# Altium schematic sheet motor_controller_interface.SchDoc: RMS & Precharge Interface
size A4; Engineer: Shelby Riggleman; Organization: Badgerloop Electrical; Address1: 133 Engineering Research Building; Address2: 1500 Engineering Drive; Address3: Madison, Wi 53706; Revision: A
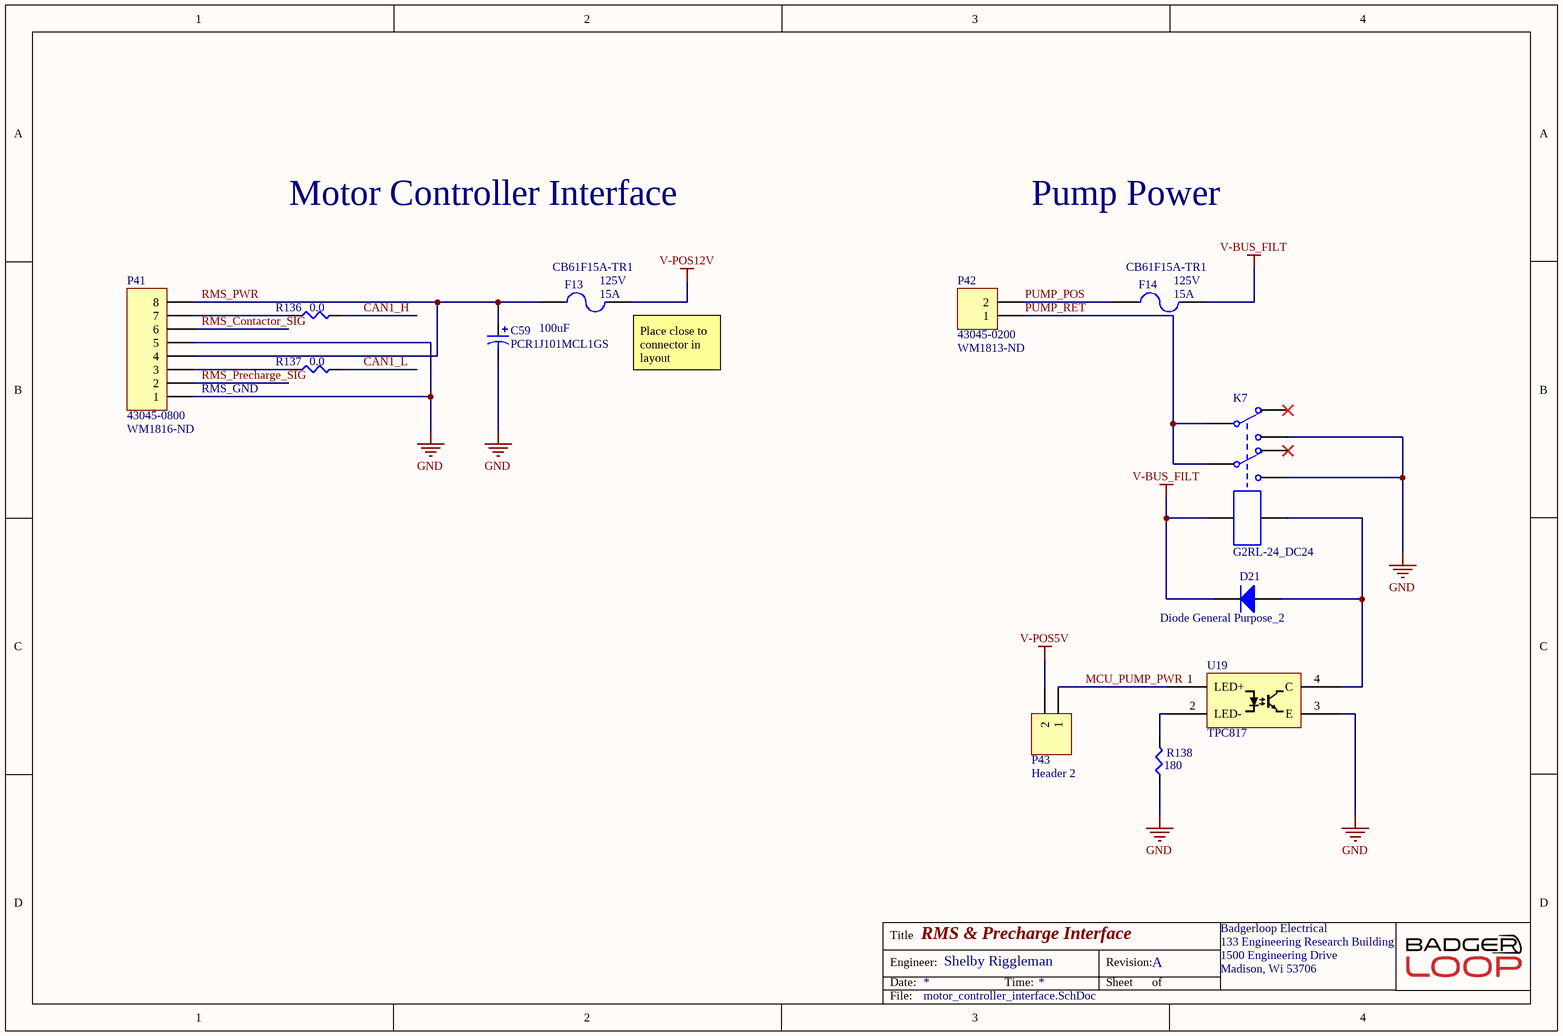
[diagram p0: motor_controller_interface.SchDoc]

## Parts
C59  PCR1J101MCL1GS  Capacitance: 100uF  [CAPAE110103X126M]
D21  Diode General Purpose_2  [SODFL250X110-2N]
F13  CB61F15A-TR1  Current Rating: 15A  Voltage Rating: 125V  [RESC6132X26N]
F14  CB61F15A-TR1  Current Rating: 15A  Voltage Rating: 125V  [RESC6132X26N]
K7  G2RL-24_DC24  [G2RL]
P41  43045-0800  Supplier Part Number 1: WM1816-ND  [430450800]
P42  43045-0200  Supplier Part Number 1: WM1813-ND  [430450200]
P43  Header 2  [Pin Header 1x2 TH Pitch 2.54mm]
R136  0.0  [SMD-1206-RES]
R137  0.0  [SMD-1206-RES]
R138  180  [SMD-0805-RES]
U19  TPC817  [SOT200P1005X328-5N]

## Nets
GND: C59.2 K7.4 K7.7 P41.1 P41.5 R138.1 U19.3(E)
V-BUS_FILT: D21.2(K) F14.2 K7.1
V-POS5V: P43.2
V-POS12V: F13.2
CAN1_H: R136.2
CAN1_L: R137.2
MCU_PUMP_PWR: P43.1 U19.1(LED+)
PUMP_POS: F14.1 P42.2
PUMP_RET: K7.3 K7.6 P42.1
RMS_Contactor_SIG: P41.6
RMS_Precharge_SIG: P41.2
RMS_PWR: C59.1 F13.1 P41.4 P41.8
NetD21_1: D21.1(A) K7.8 U19.4(C)
NetP41_3: P41.3 R137.1
NetP41_7: P41.7 R136.1
NetR138_2: R138.2 U19.2(LED-)

Not connected (* = marked no-connect by the designer): K7 2* 5*

## Notes on the sheet
- Motor Controller Interface
- Pump Power
- (near F13) Place close to connector in layout
- (near P41) RMS_GND
- Title
- Engineer:
- Date:
- Time:
- Revision:
- Sheet
- of
- File:

## Library data of the parts
C59 = PCR1J101MCL1GS: CAP ALUM POLY 100UF 20% 63V SMD; Manufacturer: Nichicon; ESR (Equivalent Series Resistance): 24mR; Ripple Current: 3A; Leakage Current: 3uA; Life (Hours): 4000Hour; Dissipation Factor: 0.08%; Supplier 1: Digi-Key; Manufacturer Part Number: PCR1J101MCL1GS; Stock 1: 11476; Pricing 1: 1=3.63000, 10=2.92800, 100=2.28380 (USD); RoHS: Yes; Mount: Surface Mount,PCB; Case/Package: Radial; Weight: 0.045856oz; Min Operating Temperature: -55°C; Max Operating Temperature: 125°C; Tolerance: 20%; Voltage Rating (DC): 63V; Package Quantity: 1; Packaging: Tape and Reel; Voltage Rating: 63V; Termination: SMD/SMT; Voltage: 63V; Diameter: 10mm; Length: 12.7mm; Height: 12.7mm; Height - Seated (Max): 0.504inch; Depth: 10.3mm; Lead Pitch: 4.6mm; Lead Free: Lead Free; ComponentLink1URL: https://datasheet.ciiva.com/29551/e-ch-ta-29551389.pdf?src-supplier=Digi-Key; ComponentLink1Description: https://datasheet.ciiva.com/29551/e-ch-ta-29551389.pdf?src-supplier=Digi-Key; ComponentLink2URL: https://datasheet.ciiva.com/29551/e-ch-ta-29551390.pdf?src-supplier=Digi-Key; ComponentLink2Description: https://datasheet.ciiva.com/29551/e-ch-ta-29551390.pdf?src-supplier=Digi-Key; ComponentLink3URL: https://datasheet.ciiva.com/29551/e-ch-ta-29551391.pdf?src-supplier=Digi-Key; ComponentLink3Description: https://datasheet.ciiva.com/29551/e-ch-ta-29551391.pdf?src-supplier=Digi-Key; Supplier Part Number 1: 493-13783-1-ND
D21 = Diode General Purpose_2: DIODE GEN PURP 20V 350MA SOD323; Manufacturer: Diodes Incorporated; Manufacturer P/N: SD103CWS-7-F; Digikey P/N: SD103CWS-FDIDKR-ND; Package / Case: SOD323; Do Not Populate: *; ComponentLink1Description: Digikey; ComponentLink1URL: https://www.digikey.com/product-detail/en/diodes-incorporated/SD103CWS-7-F/SD103CWS-FDIDKR-ND/1836772; ComponentLink2Description: Datasheet; ComponentLink2URL: https://www.diodes.com/assets/Datasheets/ds30101.pdf; ComponentLink3Description: Dimensions; ComponentLink3URL: https://www.diodes.com/assets/Package-Files/SOD323.pdf
F13 F14 = CB61F15A-TR1: Manufacturer: Eaton; DC Cold Resistance: 4mR; Fuse Type: Board Mount (Cartridge Style Excluded); Approvals: cULus,PSE; Supplier 1: Digi-Key; Manufacturer Part Number: CB61F15A-TR1; Stock 1: 11809; Pricing 1: 1=1.15000, 5=1.11800, 10=1.04600, 50=0.86600, 100=0.72160, 250=0.70356, 500=0.59532 (USD); RoHS: Yes; Mount: Surface Mount; Case/Package: SMD/SMT; Packaging: Tape and Reel; Voltage Rating (AC): 125V; Voltage Rating (DC): 125V; Length: 0.24inch; Height: 0.101inch; Width: 0.101inch; Depth: 2.57mm; Lead Free: Lead Free; ComponentLink1URL: http://components.arrow.com/part/dataview/0323_05918082?src-supplier=Arrow+Europe; ComponentLink1Description: http://components.arrow.com/part/dataview/0323_05918082?src-supplier=Arrow+Europe; ComponentLink2URL: http://www.cooperindustries.com/content/dam/public/bussmann/Electronics/Resources/product-datasheets/bus-elx-ds-4377-cb61f.pdf?src-supplier=Avnet+Asia; ComponentLink2Description: http://www.cooperindustries.com/content/dam/public/bussmann/Electronics/Resources/product-datasheets/bus-elx-ds-4377-cb61f.pdf?src-supplier=Avnet+Asia; ComponentLink3URL: http://www.cooperindustries.com/content/dam/public/bussmann/Electronics/Resources/product-datasheets/bus-elx-ds-4377-cb61f.pdf?src-supplier=Avnet; ComponentLink3Description: http://www.cooperindustries.com/content/dam/public/bussmann/Electronics/Resources/product-datasheets/bus-elx-ds-4377-cb61f.pdf?src-supplier=Avnet; ComponentLink4URL: http://www.cooperindustries.com/content/dam/public/bussmann/Electronics/Resources/product-datasheets/bus-elx-ds-4377-cb61f.pdf?src-supplier=Digi-Key; ComponentLink4Description: http://www.cooperindustries.com/content/dam/public/bussmann/Electronics/Resources/product-datasheets/bus-elx-ds-4377-cb61f.pdf?src-supplier=Digi-Key; Supplier Part Number 1: 283-4104-1-ND
K7 = G2RL-24_DC24: RELAY GEN PURPOSE DPDT 8A 24V; Manufacturer: Omron; Manufacturer Part Number: G2RL-24-DC24; Voltage Rating (AC): 440V; Voltage Rating (DC): 300V; Power Consumption: 400mW; Coil Resistance: 1.44kR; Coil Current: 16.7mA; Operate Time: 15ms; Coil Type: Non-Latching; Relay Type: General Purpose; Release Time: 5ms; Supplier 1: Digi-Key; Stock 1: 13387; Pricing 1: 1=4.32, 10=4.053, 25=3.6028, 50=3.4226, 100=3.2425, 250=2.88224, 500=2.7021 (USD); Mount: Through Hole; Case/Package: DIP; Number of Pins: 8; Weight: 12g; Contact Material: Silver,Cadmium; Min Operating Temperature: -40°C; Max Operating Temperature: 85°C; Max Current Rating: 8A; Packaging: Bulk; Max Voltage Rating (AC): 440V; Max Voltage Rating (DC): 300V; Package Quantity: 20; Throw Configuration: DPDT; Termination: PC Pin; Contact Current Rating: 8A; Coil Voltage (DC): 24V; Coil Power: 400mW; Power Rating: 400mW; Length: 29mm; Height: 15.7mm; Width: 12.7mm; Depth: 12.7mm; Radiation Hardening: No; Lead Free: Lead Free; ComponentLink1URL: http://www.alliedelec.com/images/products/datasheets/bm/OMRON_ELECTRONICS_LLC/70175264.pdf?src-supplier=Allied+Electronics; ComponentLink1Description: http://www.alliedelec.com/images/products/datasheets/bm/OMRON_ELECTRONICS_LLC/70175264.pdf?src-supplier=Allied+Electronics; ComponentLink2URL: http://www.mouser.com/ds/2/307/en-g2rl-472571.pdf?src-supplier=Mouser; ComponentLink2Description: http://www.mouser.com/ds/2/307/en-g2rl-472571.pdf?src-supplier=Mouser
P41 = 43045-0800: CONN HEADER R/A 8POS 3MM; Manufacturer: Molex; Number of Contacts: 8; Contact Resistance: 10mR; Max Voltage Rating (DC): 250.25kV; Current Rating: 5A; Voltage Rating (AC): 250V; Voltage Rating: 600V; Gender: Male; Insulation Resistance: 1GR; Approvals: UL,CSA,TUV; Glow Wire Compliant: Compliant; Supplier 1: Digi-Key; Manufacturer Part Number: 43045-0800; Stock 1: 2632; Pricing 1: 1=1.91000, 10=1.73100, 100=1.48390, 500=1.23656, 1000=1.05990, 5000=0.93978, 10000=0.91858 (USD); RoHS: Yes; Mount: Through Hole; Case/Package: SMC; Contact Plating: Tin; Contact Material: Brass,Tin; Color: Black; Housing Color: Black; Housing Material: Thermoplastic; Material: Polyester; Min Operating Temperature: -40°C; Max Operating Temperature: 105°C; Number of Rows: 2; Termination: Solder; Packaging: Tray; Number of Positions: 8; Orientation: Right Angle; Number of Poles: 8; Package Quantity: 1440; Max Current Rating: 5A; Number of Circuits: 8; Working Voltage: 250V; Voltage Rating (DC): 250V; Diameter: 3mm; Length: 16.15mm; Height: 8.77mm; Pitch: 3mm; Row Spacing: 3mm; Depth: 12.2mm; Radiation Hardening: No; Flammability Rating: UL94 V-0; REACH SVHC: Unknown; Halogen Free: Low Halogen; Lead Free: Lead Free; ComponentLink1URL: https://datasheet.ciiva.com/5158/0430450800-pcb-headers-142625-5158817.pdf?src-supplier=Mouser; ComponentLink1Description: https://datasheet.ciiva.com/5158/0430450800-pcb-headers-142625-5158817.pdf?src-supplier=Mouser; ComponentLink2URL: https://datasheet.ciiva.com/7683/27645-7683683.pdf?src-supplier=Element14; ComponentLink2Description: https://datasheet.ciiva.com/7683/27645-7683683.pdf?src-supplier=Element14; ComponentLink3URL: https://datasheet.ciiva.com/19462/883536-19462164.pdf?src-supplier=Jameco; ComponentLink3Description: https://datasheet.ciiva.com/19462/883536-19462164.pdf?src-supplier=Jameco; ComponentLink4URL: https://datasheet.ciiva.com/11751/0900766b80027348-11751142.pdf?src-supplier=RSComponents; ComponentLink4Description: https://datasheet.ciiva.com/11751/0900766b80027348-11751142.pdf?src-supplier=RSComponents; ComponentLink5URL: https://datasheet.ciiva.com/30198/267770430450800-pcb-headers-30198875.pdf?src-supplier=Onlinecomponents.com; ComponentLink5Description: https://datasheet.ciiva.com/30198/267770430450800-pcb-headers-30198875.pdf?src-supplier=Onlinecomponents.com; ComponentLink6URL: https://datasheet.ciiva.com/1443/1850016-1443537.pdf?src-supplier=Element14; ComponentLink6Description: https://datasheet.ciiva.com/1443/1850016-1443537.pdf?src-supplier=Element14; ComponentLink7URL: https://datasheet.ciiva.com/14155/04402310-14155206.pdf?src-supplier=Distrelec; ComponentLink7Description: https://datasheet.ciiva.com/14155/04402310-14155206.pdf?src-supplier=Distrelec; ComponentLink8URL: https://datasheet.ciiva.com/16657/0430450800-pcb-headers-16657964.pdf?src-supplier=Avnet+Europe; ComponentLink8Description: https://datasheet.ciiva.com/16657/0430450800-pcb-headers-16657964.pdf?src-supplier=Avnet+Europe; ComponentLink9URL: https://datasheet.ciiva.com/10087/0430450800-pcb-headers-10087853.pdf?src-supplier=Avnet; ComponentLink9Description: https://datasheet.ciiva.com/10087/0430450800-pcb-headers-10087853.pdf?src-supplier=Avnet
P42 = 43045-0200: CONN HEADER R/A 2POS; Manufacturer: Molex; Contact Resistance: 10mR; Number of Contacts: 2; Voltage Rating: 600V; Current Rating: 5A; Gender: Male; Max Voltage Rating (DC): 250.25kV; Voltage Rating (DC): 250V; Insulation Resistance: 1GR; Pitch: 3mm; Glow Wire Compliant: Compliant; Approvals: UL,CSA,TUV; Supplier 1: Digi-Key; Manufacturer Part Number: 43045-0200; Stock 1: 6320; Pricing 1: 1=0.97000, 10=0.84900, 100=0.73280, 500=0.59958, 1000=0.53296, 5000=0.46634, 10000=0.44302 (USD); RoHS: Yes; Mount: Through Hole; Case/Package: SMC; Contact Plating: Tin; Color: Black; Contact Material: Brass,Tin; Housing Color: Black; Housing Material: Thermoplastic; Material: Thermoplastic; Min Operating Temperature: -40°C; Max Operating Temperature: 105°C; Termination: Through Hole; Number of Rows: 2; Orientation: Right Angle; Packaging: Tray; Number of Positions: 2; Package Quantity: 3168; Number of Circuits: 2; Contact Gender: Male; Diameter: 3mm; Row Spacing: 3mm; Radiation Hardening: No; Flammability Rating: UL94 V-0; REACH SVHC: Unknown; Lead Free: Lead Free; Halogen Free: Low Halogen; ComponentLink1URL: https://datasheet.ciiva.com/14155/04402310-14155203.pdf?src-supplier=Distrelec; ComponentLink1Description: https://datasheet.ciiva.com/14155/04402310-14155203.pdf?src-supplier=Distrelec; ComponentLink2URL: https://datasheet.ciiva.com/19454/883270-19454006.pdf?src-supplier=Jameco; ComponentLink2Description: https://datasheet.ciiva.com/19454/883270-19454006.pdf?src-supplier=Jameco; ComponentLink3URL: https://datasheet.ciiva.com/5150/0430450200-pcb-headers-145770-5150407.pdf?src-supplier=Mouser; ComponentLink3Description: https://datasheet.ciiva.com/5150/0430450200-pcb-headers-145770-5150407.pdf?src-supplier=Mouser; ComponentLink4URL: https://datasheet.ciiva.com/11747/0900766b80027348-11747001.pdf?src-supplier=RSComponents; ComponentLink4Description: https://datasheet.ciiva.com/11747/0900766b80027348-11747001.pdf?src-supplier=RSComponents; ComponentLink5URL: https://datasheet.ciiva.com/16656/0430450200-pcb-headers-16656330.pdf?src-supplier=Avnet+Europe; ComponentLink5Description: https://datasheet.ciiva.com/16656/0430450200-pcb-headers-16656330.pdf?src-supplier=Avnet+Europe; ComponentLink6URL: https://datasheet.ciiva.com/10090/0430450200-pcb-headers-10090299.pdf?src-supplier=Avnet; ComponentLink6Description: https://datasheet.ciiva.com/10090/0430450200-pcb-headers-10090299.pdf?src-supplier=Avnet; ComponentLink7URL: https://datasheet.ciiva.com/36854/124280430450200-pcb-headers-36854331.pdf?src-supplier=Onlinecomponents.com; ComponentLink7Description: https://datasheet.ciiva.com/36854/124280430450200-pcb-headers-36854331.pdf?src-supplier=Onlinecomponents.com; ComponentLink8URL: https://datasheet.ciiva.com/1443/1859921-1443437.pdf?src-supplier=Element14; ComponentLink8Description: https://datasheet.ciiva.com/1443/1859921-1443437.pdf?src-supplier=Element14
P43 = Header 2: Header, 2-Pin; LatestRevisionDate: 17-Jul-2002; LatestRevisionNote: Re-released for DXP Platform.; Publisher: Altium Limited
R136 R137 = ERJ-8GEY0R00V: RES SMD 0.0 OHM JUMPER 1/4W 1206; Manufacturer: Panasonic Electronic Components; Factory Stock: 0; Unit Price (USD): 0.00768; @ qty: 1500; Minimum Quantity: 1; Power (Watts): 0.25W, 1/4W; Part Number: ERJ-8GEY0R00V; Datasheets: http://industrial.panasonic.com/www-cgi/jvcr13pz.cgi?E+PZ+3+AOA0001+ERJ8GEY0R00V+7+WW; Image: //media.digikey.com/Renders/Panasonic%20Renders/ERJ-1206%20Pkg.jpg; Digi-Key Part Number: P0.0ECT-ND; Quantity Available: 1074190; Packaging: Cut Tape (CT); Series: ERJ; Part Status: Active; Value: 0.0; Tolerance: Jumper; Composition: Thick Film; Features: Automotive AEC-Q200; Temperature Coefficient: -; Operating Temperature: -55°C ~ 155°C; Package / Case: 1206 (3216 Metric); Supplier Device Package: 1206; Size / Dimension: 0.126" L x 0.063" W (3.20mm x 1.60mm); Height - Seated (Max): 0.028" (0.70mm); Number of Terminations: 2; Failure Rate: -
R138 = ERJ-6ENF1800V: RES SMD 180 OHM 1% 1/8W 0805; Manufacturer: Panasonic Electronic Components; Factory Stock: 0; Unit Price (USD): 0.00729; @ qty: 1500; Minimum Quantity: 1; Power (Watts): 0.125W, 1/8W; Temperature Coefficient: ±100ppm/°C; Part Number: ERJ-6ENF1800V; Datasheets: http://industrial.panasonic.com/www-cgi/jvcr13pz.cgi?E+PZ+3+AOA0002+ERJ6ENF1800V+7+WW; Image: //media.digikey.com/Renders/Panasonic%20Renders/ERJ-0805%20Pkg.jpg; Digi-Key Part Number: P180CCT-ND; Quantity Available: 33231; Packaging: Cut Tape (CT); Series: ERJ; Part Status: Active; Value: 180; Tolerance: ±1%; Composition: Thick Film; Features: Automotive AEC-Q200; Operating Temperature: -55°C ~ 155°C; Package / Case: 0805 (2012 Metric); Supplier Device Package: 0805; Size / Dimension: 0.079" L x 0.049" W (2.00mm x 1.25mm); Height - Seated (Max): 0.028" (0.70mm); Number of Terminations: 2; Failure Rate: -
U19 = TPC817: OPTOISO 5KV TRANS 4SOP; Manufacturer: Taiwan Semi; Manufacturer P/N: TPC817S1B RAG; Digikey Link: https://www.digikey.com/product-detail/en/taiwan-semiconductor-corporation/TPC817S1B-RAG/TPC817S1BRAGCT-ND/7359679; Digikey P/N: TPC817S1BRAGCT-ND